# EasyEDA Pro project NUEVO board Rev. B.epro, board PCB8
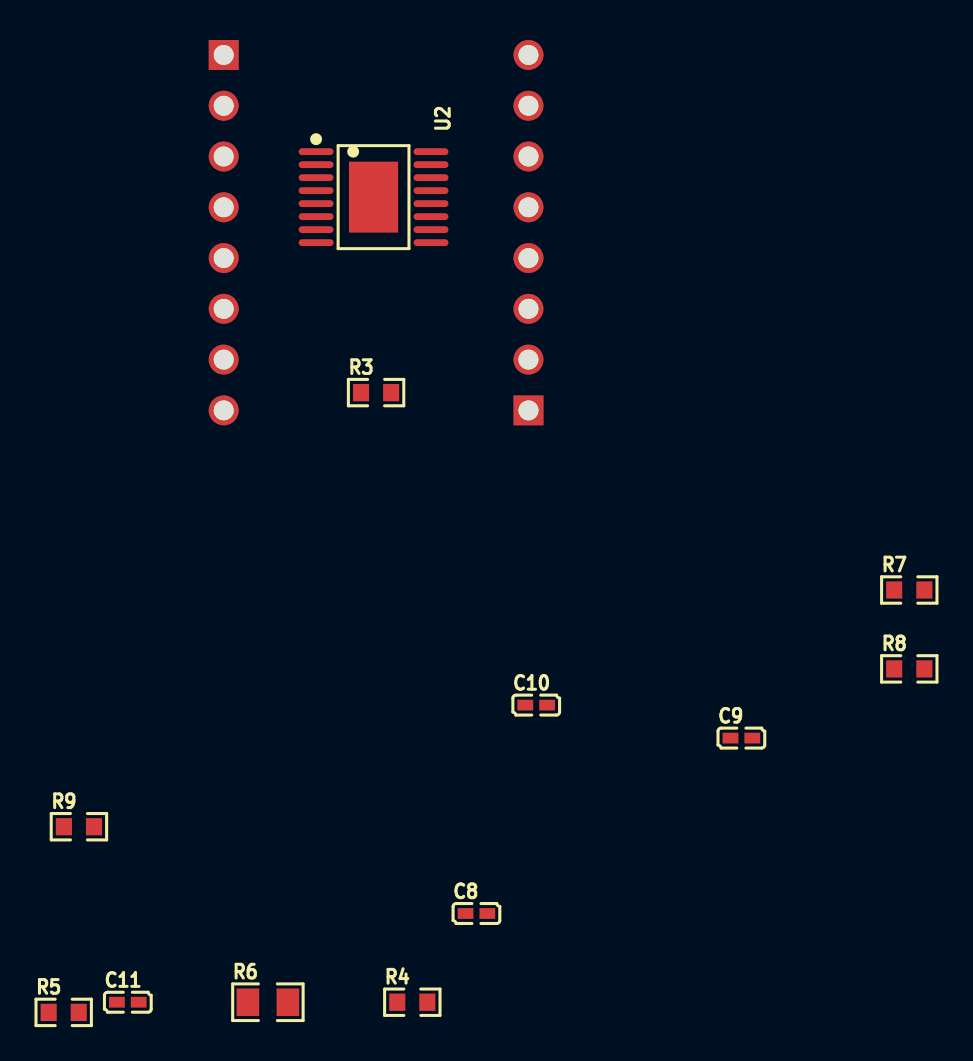
[diagram p6: board, top side]
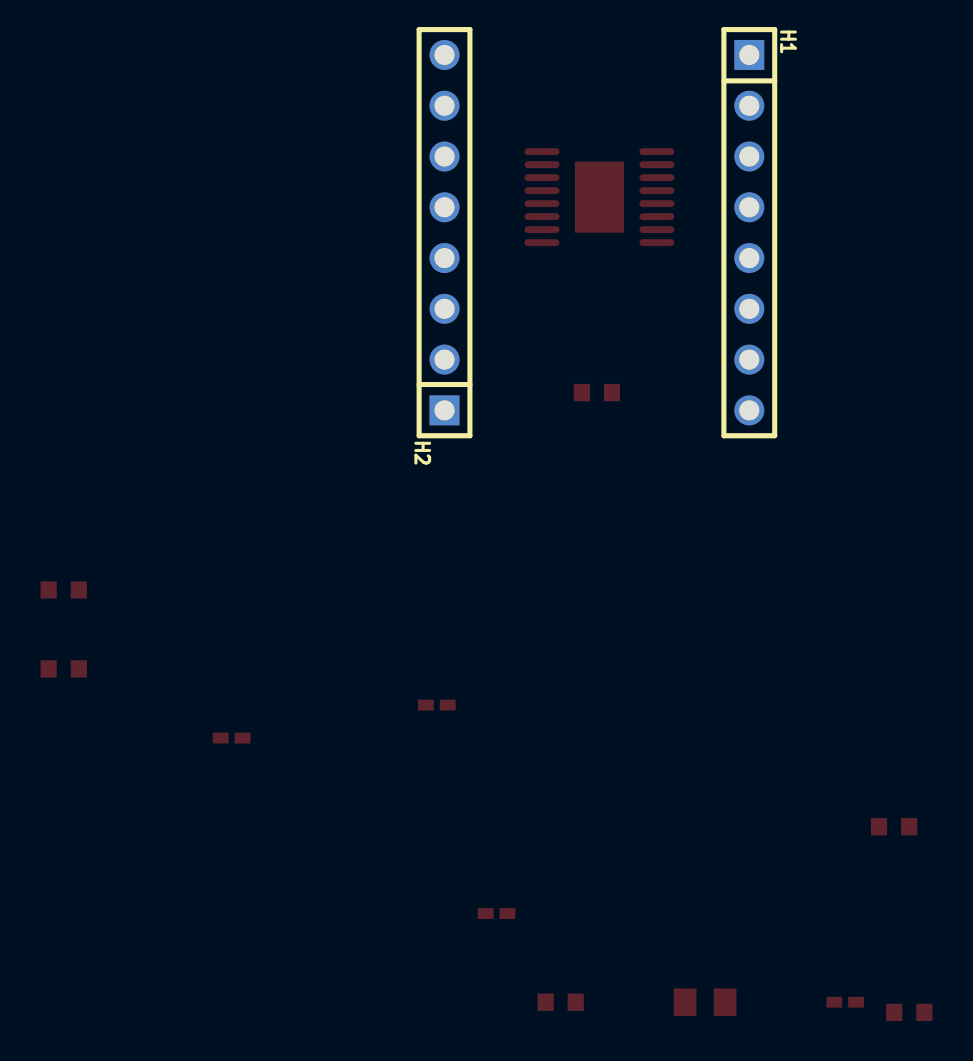
[diagram p7: board, bottom side, seen from below]

No outline. copper layers: Top Layer, Bottom Layer. Coordinates in mm from the lowest, leftmost part position.
Stack: Top Layer 0.035mm / Dielectric1 1.51mm FR4 er 4.5 / Bottom Layer 0.035mm

## Design rules (mm)
template: JLCPCB Capability(Two Layers Board)
spacing copperThickness1oz (default): track to track 0.102, other pairs 0.152 to 0.3
spacing copperThickness2oz: track to track 0.203, other pairs 0.152 to 0.3
track width copperThickness1oz (default): min 0.127, default 0.254, max 2.54
track width copperThickness2oz: min 0.203, default 0.254, max 2.54
differential pair differentialPair (default): width min 0.127, default 0.254, max 2.54; gap min 0.152, default 0.152
via viaSize (default): diameter min 0.5, default 0.61, max 10; hole min 0.3, default 0.305, max 6.3

## Placement (name value [footprint] x y rotation side)
C8  100nF  [C0402]  20.64 4.95 0 top
C9  100nF  [C0402]  33.89 13.72 0 top
C10  22nF  [C0402]  23.63 15.37 0 top
C11  10nF  [C0402]  3.21 0.51 0 top
H1  HX PZ2.54-1x8P ZZ  [HDR-TH_8P-P2.54-V-M]  8 39.01 270 bottom
H2  HX PZ2.54-1x8P ZZ  [HDR-TH_8P-P2.54-V-M]  23.24 39.01 90 bottom
R3  100kΩ  [R0603]  15.62 31.01 0 top
R4  100kΩ  [R0603]  17.43 0.51 0 top
R5  100kΩ  [R0603]  0 0 0 top
R6  20kΩ  [R0805]  10.21 0.51 0 top
R7  100kΩ  [R0603]  42.28 21.13 0 top
R8  100kΩ  [R0603]  42.28 17.18 0 top
R9  2.74kΩ  [R0603]  0.76 9.29 0 top
U2  DRV8874PWPR  [HTSSOP-16_L5.0-W4.4-P0.65-LS6.4-BL-EP]  15.49 40.78 270 top

## Footprints (pads in the part's own frame, mm; a bottom-side part is the same pattern mirrored in y, then rotated)
C0402
  rect 0.79x0.54 smd: 1(-0.545,0) 2(0.545,0)
HDR-TH_8P-P2.54-V-M
  rect 1.5x1.5 hole 1: 1(-8.89,0)
  round 1.5 hole 1: 2(-6.35,0) 3(-3.81,0) 4(-1.27,0) 5(1.27,0) 6(3.81,0) 7(6.35,0) 8(8.89,0)
HTSSOP-16_L5.0-W4.4-P0.65-LS6.4-BL-EP
  oval 0.343x1.746 smd: 1(-2.275,-2.873) 2(-1.625,-2.873) 3(-0.975,-2.873) 4(-0.325,-2.873) 5(0.325,-2.873) 6(0.975,-2.873) 7(1.625,-2.873) 8(2.275,-2.873) 9(2.275,2.873) 10(1.625,2.873) 11(0.975,2.873) 12(0.325,2.873) 13(-0.325,2.873) 14(-0.975,2.873) 15(-1.625,2.873) 16(-2.275,2.873)
  rect 3.55x2.46 smd: 17(0,0)
R0603
  rect 0.806x0.864 smd: 1(-0.753,0) 2(0.753,0)
R0805
  rect 1.133x1.377 smd: 1(-1,0) 2(1,0)

## Nets
As in the schematic, except:
$1N465: C8.2 H2.7 U2.9 U2.15
$1N1003: C8.1 C9.2 U2.11

Pads without a net: H1 3 4; R3 1
